# Altium schematic sheet Conn&PWR.SchDoc
size A4; SheetNumber: 2; SheetTotal: 4
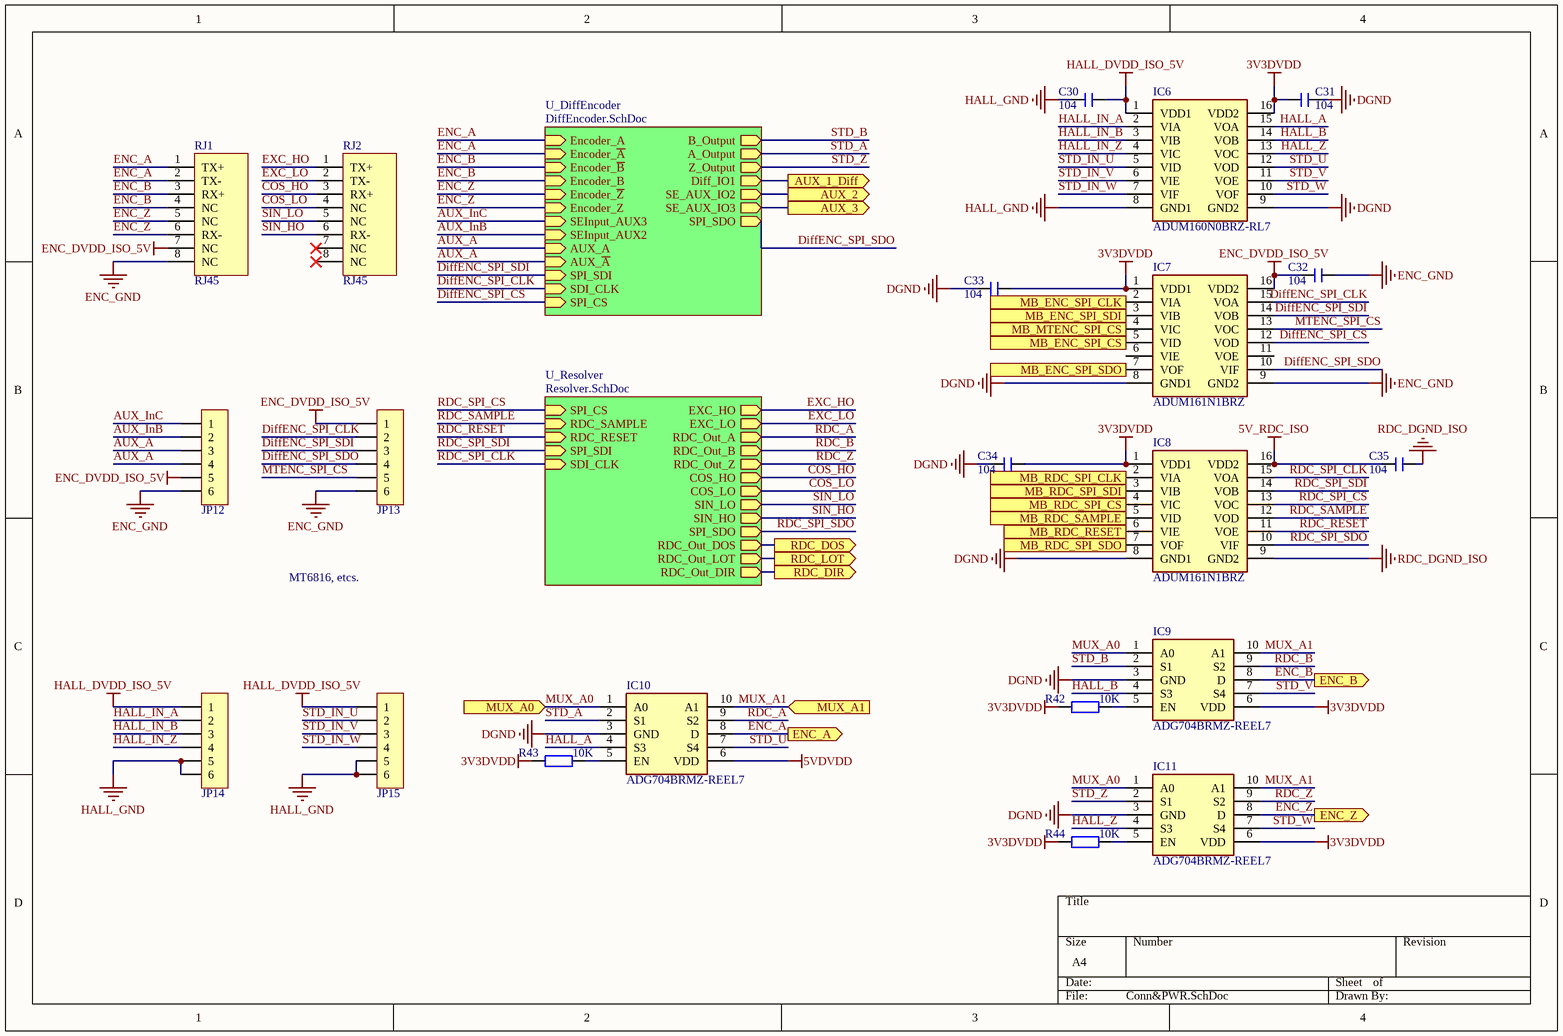
[diagram p0: Conn&PWR.SchDoc]

## Parts
C30  104  [C 0603_L]
C31  104  [C 0603_L]
C32  104  [C 0603_L]
C33  104  [C 0603_L]
C34  104  [C 0603_L]
C35  104  [C 0603_L]
IC6  ADUM160N0BRZ-RL7  [SOIC127P600X175-16N]
IC7  ADUM161N1BRZ  [SOIC127P600X175-16N]
IC8  ADUM161N1BRZ  [SOIC127P600X175-16N]
IC9  ADG704BRMZ-REEL7  [SOP50P490X110-10N]
IC10  ADG704BRMZ-REEL7  [SOP50P490X110-10N]
IC11  ADG704BRMZ-REEL7  [SOP50P490X110-10N]
JP12  HDR-1X6  [KF2EDGK5.08-LI-6P]  (value not drawn)
JP13  HDR-1X6  [KF2EDGK5.08-LI-6P]  (value not drawn)
JP14  HDR-1X6  [KF2EDGK5.08-LI-6P]  (value not drawn)
JP15  HDR-1X6  [KF2EDGK5.08-LI-6P]  (value not drawn)
R42  10K  [R 0603_L]
R43  10K  [R 0603_L]
R44  10K  [R 0603_L]
RJ1  RJ45  [RJ45-2]
RJ2  RJ45  [RJ45-2]

## Sub-sheets
U_DiffEncoder = DiffEncoder.SchDoc: Encoder_A (in), Encoder_~{A} (in), Encoder_~{B} (in), Encoder_B (in), Encoder_~{Z} (in), Encoder_Z (in), B_Output (out), A_Output (out), Z_Output (out), SEInput_AUX3 (in), Diff_IO1 (out), SEInput_AUX2 (in), AUX_A (in), AUX_~{A} (in), SE_AUX_IO2 (out), SE_AUX_IO3 (out), SPI_SDI (in), SDI_CLK (in), SPI_CS (in), SPI_SDO (out)
U_Resolver = Resolver.SchDoc: EXC_HO (out), EXC_LO (out), RDC_Out_A (out), RDC_Out_B (out), RDC_Out_Z (out), COS_HO (out), COS_LO (out), SIN_LO (out), SIN_HO (out), SPI_CS (in), RDC_SAMPLE (in), RDC_RESET (in), SPI_SDI (in), SPI_SDO (out), SDI_CLK (in), RDC_Out_DOS (out), RDC_Out_LOT (out), RDC_Out_DIR (out)

## Ports
AUX_1_Diff (out), AUX_2 (out), AUX_3 (out), ENC_A (out), ENC_B (out), ENC_Z (out), MB_ENC_SPI_CLK (in), MB_ENC_SPI_CS (in), MB_ENC_SPI_SDI (in), MB_ENC_SPI_SDO (out), MB_MTENC_SPI_CS (in), MB_RDC_RESET (in), MB_RDC_SAMPLE (in), MB_RDC_SPI_CLK (in), MB_RDC_SPI_CS (in), MB_RDC_SPI_SDI (in), MB_RDC_SPI_SDO (out), MUX_A0 (in), MUX_A1 (in), RDC_DIR (out), RDC_DOS (out), RDC_LOT (out)

## Nets
3V3DVDD: C31.2 C33.1 C34.1 IC6.16(VDD2) IC7.1(VDD1) IC8.1(VDD1) IC9.6(VDD) IC11.6(VDD) R42.2 R43.2 R44.2
5V_RDC_ISO: C35.2 IC8.16(VDD2)
5VDVDD: IC10.6(VDD)
DGND: C31.1 C33.2 C34.2 IC6.9(GND2) IC7.8(GND1) IC8.8(GND1) IC9.3(GND) IC10.3(GND) IC11.3(GND)
ENC_DVDD_ISO_5V: C32.2 IC7.16(VDD2) JP12.5 JP13.1 RJ1.7(NC)
ENC_GND: C32.1 IC7.9(GND2) JP12.6 JP13.6 RJ1.8(NC)
HALL_DVDD_ISO_5V: C30.1 IC6.1(VDD1) JP14.1 JP15.1
HALL_GND: C30.2 IC6.8(GND1) JP14.5 JP14.6 JP15.5 JP15.6
RDC_DGND_ISO: C35.1 IC8.9(GND2)
AUX_1_Diff: port AUX_1_Diff, sheet U_DiffEncoder/Diff_IO1
AUX_2: port AUX_2, sheet U_DiffEncoder/SE_AUX_IO2
AUX_3: port AUX_3, sheet U_DiffEncoder/SE_AUX_IO3
AUX_A: JP12.3 ; sheet U_DiffEncoder/AUX_A
AUX_~{A}: JP12.4 ; sheet U_DiffEncoder/AUX_~{A}
AUX_InB: JP12.2 ; sheet U_DiffEncoder/SEInput_AUX2
AUX_InC: JP12.1 ; sheet U_DiffEncoder/SEInput_AUX3
COS_HO: RJ2.3(RX+) ; sheet U_Resolver/COS_HO
COS_LO: RJ2.4(NC) ; sheet U_Resolver/COS_LO
DiffENC_SPI_CLK: IC7.15(VOA) JP13.2 ; sheet U_DiffEncoder/SDI_CLK
DiffENC_SPI_CS: IC7.12(VOD) ; sheet U_DiffEncoder/SPI_CS
DiffENC_SPI_SDI: IC7.14(VOB) JP13.3 ; sheet U_DiffEncoder/SPI_SDI
DiffENC_SPI_SDO: IC7.10(VIF) JP13.4 ; sheet U_DiffEncoder/SPI_SDO
ENC_A: IC10.8(D) RJ1.1(TX+) ; port ENC_A, sheet U_DiffEncoder/Encoder_A
ENC_~{A}: RJ1.2(TX-) ; sheet U_DiffEncoder/Encoder_~{A}
ENC_B: IC9.8(D) RJ1.3(RX+) ; port ENC_B, sheet U_DiffEncoder/Encoder_B
ENC_~{B}: RJ1.4(NC) ; sheet U_DiffEncoder/Encoder_~{B}
ENC_Z: IC11.8(D) RJ1.5(NC) ; port ENC_Z, sheet U_DiffEncoder/Encoder_Z
ENC_~{Z}: RJ1.6(RX-) ; sheet U_DiffEncoder/Encoder_~{Z}
EXC_HO: RJ2.1(TX+) ; sheet U_Resolver/EXC_HO
EXC_LO: RJ2.2(TX-) ; sheet U_Resolver/EXC_LO
HALL_A: IC6.15(VOA) IC10.4(S3)
HALL_B: IC6.14(VOB) IC9.4(S3)
HALL_IN_A: IC6.2(VIA) JP14.2
HALL_IN_B: IC6.3(VIB) JP14.3
HALL_IN_Z: IC6.4(VIC) JP14.4
HALL_Z: IC6.13(VOC) IC11.4(S3)
MB_ENC_SPI_CLK: IC7.2(VIA) ; port MB_ENC_SPI_CLK
MB_ENC_SPI_CS: IC7.5(VID) ; port MB_ENC_SPI_CS
MB_ENC_SPI_SDI: IC7.3(VIB) ; port MB_ENC_SPI_SDI
MB_ENC_SPI_SDO: IC7.7(VOF) ; port MB_ENC_SPI_SDO
MB_MTENC_SPI_CS: IC7.4(VIC) ; port MB_MTENC_SPI_CS
MB_RDC_RESET: IC8.6(VIE) ; port MB_RDC_RESET
MB_RDC_SAMPLE: IC8.5(VID) ; port MB_RDC_SAMPLE
MB_RDC_SPI_CLK: IC8.2(VIA) ; port MB_RDC_SPI_CLK
MB_RDC_SPI_CS: IC8.4(VIC) ; port MB_RDC_SPI_CS
MB_RDC_SPI_SDI: IC8.3(VIB) ; port MB_RDC_SPI_SDI
MB_RDC_SPI_SDO: IC8.7(VOF) ; port MB_RDC_SPI_SDO
MTENC_SPI_CS: IC7.13(VOC) JP13.5
MUX_A0: IC9.1(A0) IC10.1(A0) IC11.1(A0) ; port MUX_A0
MUX_A1: IC9.10(A1) IC10.10(A1) IC11.10(A1) ; port MUX_A1
RDC_A: IC10.9(S2) ; sheet U_Resolver/RDC_Out_A
RDC_B: IC9.9(S2) ; sheet U_Resolver/RDC_Out_B
RDC_DIR: port RDC_DIR, sheet U_Resolver/RDC_Out_DIR
RDC_DOS: port RDC_DOS, sheet U_Resolver/RDC_Out_DOS
RDC_LOT: port RDC_LOT, sheet U_Resolver/RDC_Out_LOT
RDC_RESET: IC8.11(VOE) ; sheet U_Resolver/RDC_RESET
RDC_SAMPLE: IC8.12(VOD) ; sheet U_Resolver/RDC_SAMPLE
RDC_SPI_CLK: IC8.15(VOA) ; sheet U_Resolver/SDI_CLK
RDC_SPI_CS: IC8.13(VOC) ; sheet U_Resolver/SPI_CS
RDC_SPI_SDI: IC8.14(VOB) ; sheet U_Resolver/SPI_SDI
RDC_SPI_SDO: IC8.10(VIF) ; sheet U_Resolver/SPI_SDO
RDC_Z: IC11.9(S2) ; sheet U_Resolver/RDC_Out_Z
SIN_HO: RJ2.6(RX-) ; sheet U_Resolver/SIN_HO
SIN_LO: RJ2.5(NC) ; sheet U_Resolver/SIN_LO
STD_A: IC10.2(S1) ; sheet U_DiffEncoder/A_Output
STD_B: IC9.2(S1) ; sheet U_DiffEncoder/B_Output
STD_IN_U: IC6.5(VID) JP15.2
STD_IN_V: IC6.6(VIE) JP15.3
STD_IN_W: IC6.7(VIF) JP15.4
STD_U: IC6.12(VOD) IC10.7(S4)
STD_V: IC6.11(VOE) IC9.7(S4)
STD_W: IC6.10(VOF) IC11.7(S4)
STD_Z: IC11.2(S1) ; sheet U_DiffEncoder/Z_Output
NetIC9_5: IC9.5(EN) R42.1
NetIC10_5: IC10.5(EN) R43.1
NetIC11_5: IC11.5(EN) R44.1

Not connected (* = marked no-connect by the designer): IC7 6(VIE) 11(VOE); RJ2 7(NC)* 8(NC)*

## Notes on the sheet
- MT6816, etcs.

## Library data of the parts
C30-C35 = C: 贴片电容; BOM名称: 无极性贴片电容; 淘宝ID: 封装库来自淘宝 ID：黄晶宝石; 联系售后，技术支持: https://shop463601444.taobao.com; 唯一出售店铺网址: https://shop463601444.taobao.com
IC6 = ADUM160N0BRZ-RL7: Integrated Circuit; Manufacturer_Name: Analog Devices; Datasheet Link: https://www.analog.com/media/en/technical-documentation/data-sheets/adum160n-161n-162n-163n.pdf; Height: 1.75mm; Manufacturer_Part_Number: ADUM160N0BRZ-RL7; Mouser Part Number: 584-ADUM160N0BRZ-RL7; Mouser Price/Stock: https://www.mouser.co.uk/ProductDetail/Analog-Devices/ADUM160N0BRZ-RL7?qs=cslStgdnz9OW1mXsMBZKfA%3D%3D; Arrow Part Number: ADUM160N0BRZ-RL7; Arrow Price/Stock: https://www.arrow.com/en/products/adum160n0brz-rl7/analog-devices
IC7 IC8 = ADUM161N1BRZ: Integrated Circuit; Manufacturer_Name: Analog Devices; Datasheet Link: https://componentsearchengine.com/Datasheets/1/ADUM161N1BRZ.pdf; Height: 1.75mm; Manufacturer_Part_Number: ADUM161N1BRZ; Mouser Part Number: 584-ADUM161N1BRZ; Mouser Price/Stock: https://www.mouser.co.uk/ProductDetail/Analog-Devices/ADUM161N1BRZ?qs=cslStgdnz9PXnDzAofgUAA%3D%3D; Arrow Part Number: ADUM161N1BRZ; Arrow Price/Stock: https://www.arrow.com/en/products/adum161n1brz/analog-devices
IC9-IC11 = ADG704BRMZ-REEL7: Integrated Circuit; Manufacturer_Name: Analog Devices; Datasheet Link: http://componentsearchengine.com/Datasheets/1/ADG704BRMZ-REEL7.pdf; Manufacturer_Part_Number: ADG704BRMZ-REEL7; Mouser Part Number: 584-ADG704BRMZ-R7; Mouser Price/Stock: https://www.mouser.co.uk/ProductDetail/Analog-Devices/ADG704BRMZ-REEL7?qs=BpaRKvA4VqF8DSGt0vw8%252Bg%3D%3D; Arrow Part Number: ADG704BRMZ-REEL7; Arrow Price/Stock: https://www.arrow.com/en/products/adg704brmz-reel7/analog-devices?region=nac
JP12-JP15 = Header 6: 6P接插件; 版权归属: 封装库来自淘宝卖家 ID：黄晶宝石; BOM名称: 6P接插件; 学习资源: https://shop463601444.taobao.com
R42-R44 = R: 贴片电阻; 版权归属: 来自淘宝 ID：黄晶宝石; 封装库来自淘宝卖家 ID：黄晶宝石: 其他店铺购入均为盗版，不享受售后技术支持服务，请立即申请退款; BOM名称: 贴片电阻; 联系售后: https://shop463601444.taobao.com
RJ1 RJ2 = RJ45: 以太网接口; BOM名称: 以太网接口